# Altium schematic sheet [01] - TITLE SHEET_ASCII.SchDoc: Title Sheet
size Letter; Address1: See Sheet Parameters; Address2: See Sheet Parameters; Address3: See Sheet Parameters; SheetNumber: 1; SheetTotal: 4
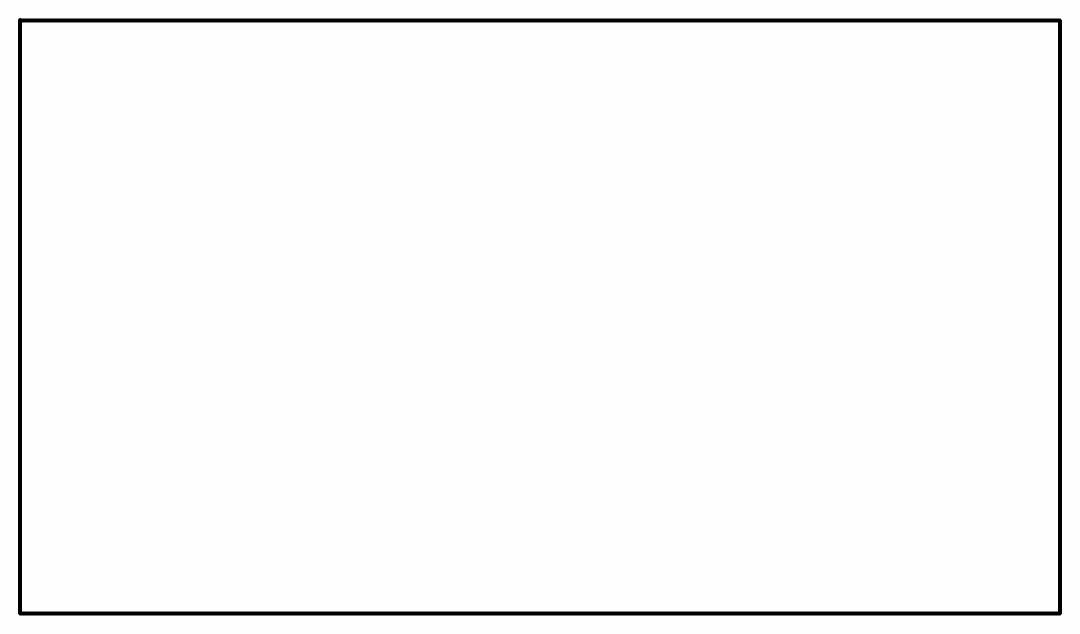
[diagram p0: [01] - TITLE SHEET_ASCII.SchDoc]

## Sub-sheets
Table of Contents = [02] - TABLE OF CONTENTS_ASCII.SchDoc: no entries

## Notes on the sheet
- Revision
- Description
- DOCUMENT REVISION HISTORY
- ECN
- Date
- Approved By
- CONFIDENTIALITY NOTICE. THIS DRAWING AND INFORMATION CONTAINED HEREIN ARE THE EXCLUSIVE PROPERTY OF [[INSERT COMPANY NAME]]. NEITHER THIS DESIGN NOR ANY INFORMATION CONTAINED IN THIS DRAWING MAY BE REPRODUCED OR DISCLOSED WITHOUT THE EXPRESS WRITTEN CONSENT OF [[INSERT COMPANY NAME]].
- CHECKER:
- DESIGNER:
- ENGINEER:
- APPROVALS
- DATE
- TITLE:
- PCB Part Number:
- PCB Rev.:
- PCB Variant:
- Replaces PCB P/N & Rev.:
- ASSY DWG:
- FAB DWG:
- PCB DWG:
- REFERNCE DOCUMENTS
- SHEET TITLE:
- SIZE
- A
- Time Stamp:
- Doc. No.:
- Doc. Rev.:
- Doc. Status:
- BOM:
- Sheet
- of